# EasyEDA Pro project foc电动螺丝刀.eprj, schematic Schematic1
Board Name: Board1; Create Date: 2025-11-18; Page Name: P1; Project Name: foc电动螺丝刀; Schematic Name: Schematic1; Update Date: 2025-12-09; Company: 嘉立创EDA; Page Size: A4; Version: V1.0
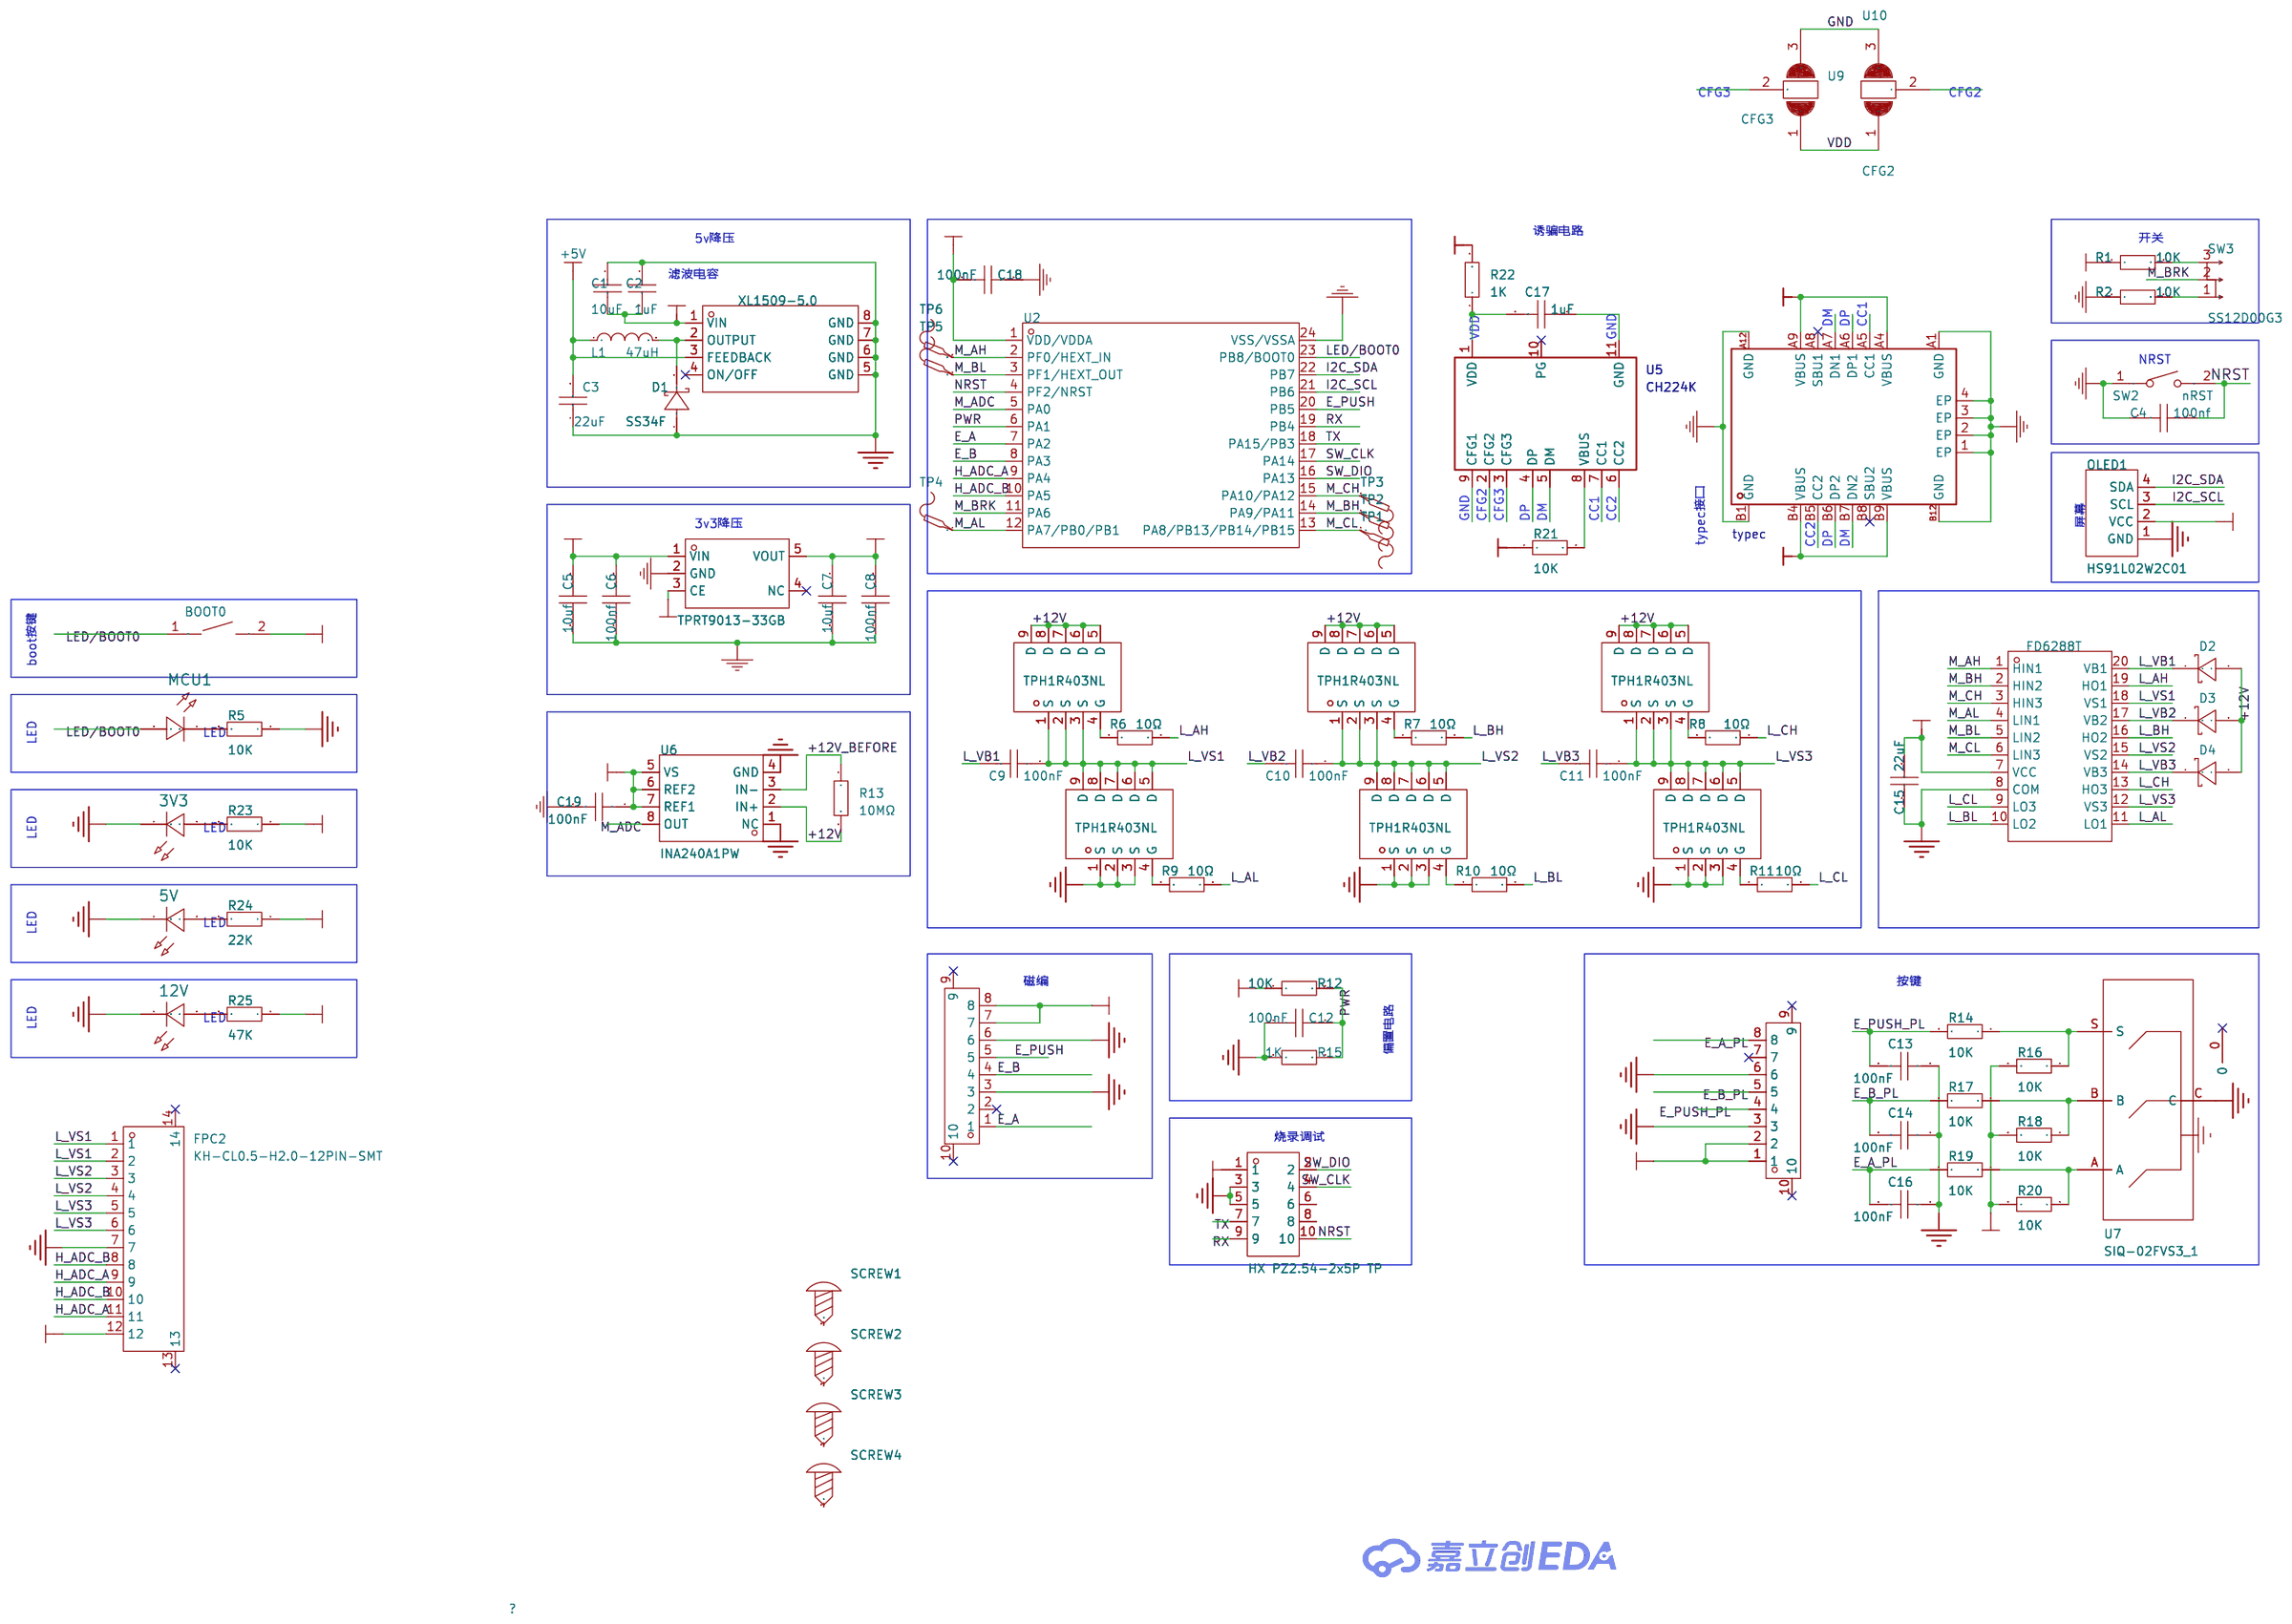
[diagram p0: schematic sheet]

## Parts
3V3  -  [LED_0603]
5V  -  [LED_0603]
12V  -  [LED_0603]
BOOT0  轻触按键3*4*H  [SW-SMD_L4.0-W2.9-LS5.0]
C1  10uF  [C1206]
C2  1uF  [C0603]
C3  22uF  [C1206]
C4  100nf  [C0603]
C5  10uf  [C1206]
C6  100nf  [C0603]
C7  10uf  [C1206]
C8  100nf  [C0603]
C9  100nF  [C0603]
C10  100nF  [C0603]
C11  100nF  [C0603]
C12  100nF  [C0603]
C13  100nF  [C0603]
C14  100nF  [C0603]
C15  22uF  [C0805]
C16  100nF  [C0603]
C17  1uF  [C0603]
C18  100nF  [C0603]
C19  100nF  [C0603]
D1  SS34F  [SMAF_L3.5-W2.6-LS4.7-FD]
D2  1N5819WS  [SOD-323_L1.8-W1.3-LS2.5-RD]
D3  1N5819WS  [SOD-323_L1.8-W1.3-LS2.5-RD]
D4  1N5819WS  [SOD-323_L1.8-W1.3-LS2.5-RD]
FPC1  FPC-05F-8PH20  [FPC-SMD_8P-P0.50_FPC-05F-8PH20]
FPC2  KH-CL0.5-H2.0-12PIN-SMT  [FPC-SMD_12P-P0.50_KH-CL0.5-H2.0-12PIN-SMT]
FPC3  FPC-05F-8PH20  [FPC-SMD_8P-P0.50_FPC-05F-8PH20]
L1  47uH  [IND-SMD_L7.0-W6.6_FXL0630]
MCU1  -  [LED_0603]
OLED1  HS91L02W2C01  [OLED-TH_L38.0-W12.0_HS91L02W2C01]
P1  HX PZ2.54-2x5P TP  [HDR-SMD_10P-P2.54-V-M-R2-C5-LS7.5]
Q1  TPH1R403NL  [DSOP-8_L5.0-W5.0-P1.27-LS6.0-BL-EP]
Q2  TPH1R403NL  [DSOP-8_L5.0-W5.0-P1.27-LS6.0-BL-EP]
Q3  TPH1R403NL  [DSOP-8_L5.0-W5.0-P1.27-LS6.0-BL-EP]
Q4  TPH1R403NL  [DSOP-8_L5.0-W5.0-P1.27-LS6.0-BL-EP]
Q5  TPH1R403NL  [DSOP-8_L5.0-W5.0-P1.27-LS6.0-BL-EP]
Q6  TPH1R403NL  [DSOP-8_L5.0-W5.0-P1.27-LS6.0-BL-EP]
R1  10K  [R0603]
R2  10K  [R0603]
R5  10K  [R0603]
R6  10Ω  [R0603]
R7  10Ω  [R0603]
R8  10Ω  [R0603]
R9  10Ω  [R0603]
R10  10Ω  [R0603]
R11  10Ω  [R0603]
R12  10K  [R0603]
R13  10MΩ  [R2512]
R14  10K  [R0603]
R15  1K  [R0603]
R16  10K  [R0603]
R17  10K  [R0603]
R18  10K  [R0603]
R19  10K  [R0603]
R20  10K  [R0603]
R21  10K  [R0603]
R22  1K  [R0603]
R23  10K  [R0603]
R24  22K  [R0603]
R25  47K  [R0603]
SCREW1  -  [M2螺丝]
SCREW2  -  [M2螺丝]
SCREW3  -  [M2螺丝]
SCREW4  -  [M2螺丝]
SW2  nRST  [SW-SMD_L4.0-W2.9-LS5.0]
SW3  SS12D00G3  [SW-TH_SS-12D01-GX]
TP1  -  [Test-Point-0.5mm]  (no BOM)
TP2  -  [Test-Point-0.5mm]  (no BOM)
TP3  -  [Test-Point-0.5mm]  (no BOM)
TP4  -  [Test-Point-0.5mm]  (no BOM)
TP5  -  [Test-Point-0.5mm]  (no BOM)
TP6  -  [Test-Point-0.5mm]  (no BOM)
U1  XL1509-5.0  [SOIC-8_L4.9-W3.9-P1.27-LS6.0-TR]
U2  -  [TSSOP-24_L7.8-W4.4-P0.65-LS6.4-BL]
U4  TPRT9013-33GB  [SOT-23-5_L3.0-W1.7-P0.95-LS2.8-BL]
U5  CH224K  [ESSOP-10_L4.9-W3.9-P1.0-LS6.0-TL-EP]
U6  INA240A1PW  [TSSOP-8_L4.4-W3.0-P0.65-LS6.4-TL]
U7  SIQ-02FVS3_1  [SW-SMD_SIQ-02FVS3_1]
U8  FD6288T  [TSSOP-20_L6.5-W4.4-P0.65-LS6.4-BL]
U9  CFG3  [双置短接焊盘]
U10  CFG2  [双置短接焊盘]
USB1  typec  [USB-C-SMD_KH-TYPE-C-16P]

## Library data of the parts
3V3 5V 12V MCU1 = LED_0603-R: Supplier Footprint: 0603
BOOT0 SW2 = 轻触按键3*4*H: Supplier Part: C9900017573; Supplier Footprint: 轻触按键3*4*2.5; JLCPCB Part Class: 扩展库; Supplier: LCSC
C1 = CL31A106KBHNNNE: 容值:10uF;精度:±10%;额定电压:50V;材质(温度系数):X5R;; LCSC Part Name: 10uF ±10% 50V; Supplier Part: C13585; Manufacturer: SAMSUNG(三星); Supplier Footprint: 1206; Datasheet: https://atta.szlcsc.com/upload/public/pdf/source/20160103/1457707668742.pdf; Supplier: LCSC; Tolerance: ±10%; Voltage Rated: 50V; Temperature Coefficient: X5R
C2 = CL10A105KB8NNNC: 容值:1uF;精度:±10%;额定电压:50V;材质(温度系数):X5R;; LCSC Part Name: 1uF ±10% 50V; Supplier Part: C15849; Manufacturer: SAMSUNG(三星); Supplier Footprint: 0603; JLCPCB Part Class: Basic Part; Datasheet: https://atta.szlcsc.com/upload/public/pdf/source/20160218/1457707763339.pdf; Supplier: LCSC; Tolerance: ±10%; Voltage Rated: 50V; Temperature Coefficient: X5R
C3 = CGA1206X5R226M350NT: 容值:22uF;精度:±20%;额定电压:35V;温度系数:X5R;; LCSC Part Name: 22uF ±20% 35V; Supplier Part: C6119969; Manufacturer: HRE(芯声); Supplier Footprint: 1206; JLCPCB Part Class: Extended Part; Datasheet: https://item.szlcsc.com/datasheet/CGA1206X5R226M350NT/7062675.html; Supplier: LCSC; Tolerance: ±20%; Voltage Rating: 35V; Temperature Coefficient: X5R
C4 C6 C8 = 100nf: link: https://item.szlcsc.com/362304.html; 3DModel: C0603_L1.6-W0.8-H0.8
C5 C7 = HGC1206R5106K500NSPJ: 容值:10uF;精度:±10%;额定电压:50V;温度系数:X5R;; LCSC Part Name: 10uF ±10% 50V; Supplier Part: C7432781; Manufacturer: Chinocera(华瓷); Supplier Footprint: 1206; JLCPCB Part Class: Extended Part; Datasheet: https://atta.szlcsc.com/upload/public/pdf/source/20240320/FAC3FEC40A78BC5CCCE96C232A94D860.pdf; Supplier: LCSC; Tolerance: ±10%; Voltage Rating: 50V; Temperature Coefficient: X5R
C9-C11 = CC0603KRX7R9BB104: 容值:100nF;精度:±10%;额定电压:50V;材质(温度系数):X7R;; LCSC Part Name: 100nF ±10% 50V; Supplier Part: C14663; Manufacturer: YAGEO(国巨); Supplier Footprint: 0603; JLCPCB Part Class: 基础库; Datasheet: https://atta.szlcsc.com/upload/public/pdf/source/20180910/C282072_33301C7F631E79921B82A8DAC6BCC5B3.pdf; Supplier: LCSC; Tolerance: ±10%; Voltage Rated: 50V; Temperature Coefficient: X7R
C12-C14 C16-C19 = CAP_0603: Supplier Footprint: 0603
C15 = CGA0805X5R226M350MT: LCSC Part Name: 22uF ±20% 35V; Supplier Part: C6119901; Manufacturer: HRE(芯声); Supplier Footprint: 0805; JLCPCB Part Class: Extended Part; Datasheet: https://atta.szlcsc.com/upload/public/pdf/source/20231129/D589D0CC4D260F7AC3A77E53B455CCB3.pdf; Supplier: LCSC; Tolerance: ±20%; Voltage Rated: 35V; Temperature Coefficient: X5R
D1 = SS34F_C908239: 二极管配置:独立式;正向压降(Vf):550mV@3A;直流反向耐压(Vr):40V;平均整流电流(Io):3A;; LCSC Part Name: 电压:40V 电流:3A; Supplier Part: C908239; Manufacturer: FUXINSEMI(富芯森美); Supplier Footprint: SMAF(DO-214AD); Datasheet: https://atta.szlcsc.com/upload/public/pdf/source/20201027/C908239_FC8ECC0377ED2542EFBAA82131BEFB7E.pdf; Supplier: LCSC; Diode Configuration: 独立式; Forward Voltage (Vf@If): 550mV@3A; Reverse Voltage (Vr): 40V; Average Rectified Current (Io): 3A; Reverse Leakage Current (Ir): 500nA
D2-D4 = 1N5819WS_C191023: 正向压降(Vf):600mV@1A;直流反向耐压(Vr):40V;平均整流电流(Io):1A;; LCSC Part Name: 电压:40V 电流:1A; Supplier Part: C191023; Manufacturer: Hottech(合科泰); Supplier Footprint: SOD-323; JLCPCB Part Class: 基础库; Datasheet: https://atta.szlcsc.com/upload/public/pdf/source/20220428/3CB86FD8D28D653594B4E35F9D5AEFD9.pdf; Supplier: LCSC; Forward Voltage (Vf@If): 600mV@1A; Reverse Voltage (Vr): 40V; Average Rectified Current (Io): 1A
FPC1 FPC3 = FPC-05F-8PH20: 锁定特性:翻盖式;触点类型:下接;触点数量:8P;间距:0.5mm;安装类型:卧贴;工作温度范围:-25℃~+85℃;; LCSC Part Name: 间距:0.5mm P数:8P 翻盖式 下接; Supplier Part: C2856797; Manufacturer: XUNPU(讯普); Supplier Footprint: SMD,P=0.5mm,卧贴; Datasheet: https://atta.szlcsc.com/upload/public/pdf/source/20210728/C2856796_EA80EFD10E16055FE067E7763B90421F.pdf; Supplier: LCSC; Locking Feature: 翻盖式; Contact Type: 下接; Number of Contacts: 8P; Pitch: 0.5mm; Mounting Type: 卧贴; FFC, FCB Thickness: 0.3mm; Height Above Board: 2mm; Operating Temperature Range: -25℃~+85℃
FPC2 = KH-CL0.5-H2.0-12PIN-SMT: LCSC Part Name: 抽屉式 下接 P数:12P 间距:0.5mm; Supplier Part: C22370889; Manufacturer: kinghelm(金航标); Supplier Footprint: SMD,P=0.5mm,卧贴; JLCPCB Part Class: 扩展库; Datasheet: https://atta.szlcsc.com/upload/public/pdf/source/20240328/5AE8AE061BAE655BE0EEC39E0F785CE5.pdf; Supplier: LCSC; Locking Feature: 抽屉式; Contact Type: 下接; Number of Contacts: 12P; Pitch: 0.5mm
L1 = FXL0630-470-M: 电感值:47uH;精度:±20%;额定电流:1.5A;饱和电流(Isat):2A;类型:一体成型电感;; LCSC Part Name: 47uH ±20% 2A; Supplier Part: C475913; Manufacturer: cjiang(长江微电); Supplier Footprint: SMD,6.6x7mm; JLCPCB Part Class: Extended Part; Datasheet: https://atta.szlcsc.com/upload/public/pdf/source/20240426/3189EA8206330E2108542F9E34E540E7.pdf; Supplier: LCSC; Tolerance: ±20%; Rated Current: 1.5A; Saturation Current (Isat): 2A; DC Resistance (DCR): 385mΩ; Type: 一体成型电感
OLED1 = HS91L02W2C01: LCSC Part Name: 0.91寸OLED显示屏白光IIC; Supplier Part: C5248081; Manufacturer: HS(汉昇); JLCPCB Part Class: 扩展库; Datasheet: https://atta.szlcsc.com/upload/public/pdf/source/20230727/C3E43C8E3DDA847F5681FEE7D95C153D.pdf; Supplier: LCSC; Main Control Chip: SSD1306; Interface Type: I2C; Size: 0.91; Pixel Resolution: 128x32; Operating Temperature: -40℃~+70℃
P1 = HX PZ2.54-2x5P TP: LCSC Part Name: 2x5P 间距:2.54mm 方针 立贴; Supplier Part: C32713285; Manufacturer: hanxia(韩下); Supplier Footprint: SMD,P=2.54mm; JLCPCB Part Class: Extended Part; Datasheet: https://item.szlcsc.com/datasheet/HX%2520PZ2.54-2x5P%2520TP/34444565.html; Supplier: LCSC; Pin Structure: 2x5P; Pitch: 2.54mm; Row Spacing: 2.54mm; Circluar Pins/Square Pins: 方针; Mounting Type: 立贴; Number of Rows: 双排; Number of Pins: 10P; Current Rating: 3A; Voltage Rating (Max): 1kV; Length of Mating Pin: 6mm; Insulation Height: 2.5mm; Contact Material: 黄铜; Contact Plating: 金; Operating Temperature: -40℃~+105℃; Color: 黑色
Q1-Q6 = TPH1R403NL_C83440: 类型:N沟道;漏源电压(Vdss):30V;连续漏极电流(Id):150A;功率(Pd):64W;导通电阻(RDS(on)@Vgs,Id):1.4mΩ@10V,30A;阈值电压(Vgs(th)@Id):2.3V@500uA;; LCSC Part Name: N沟道 耐压:30V 电流:150A; Supplier Part: C83440; Manufacturer: TOSHIBA(东芝); Supplier Footprint: DFN-8(5x6); JLCPCB Part Class: 扩展库; Datasheet: https://atta.szlcsc.com/upload/public/pdf/source/20170908/C83440_1504870121708958077.pdf; Supplier: LCSC; Type: N沟道; Drain Source Voltage (Vdss): 30V; Continuous Drain Current (Id): 150A; Power Dissipation (Pd): 64W; Drain Source On Resistance (RDS(on)@Vgs,Id): 1.4mΩ@10V,30A; Gate Threshold Voltage (Vgs(th)@Id): 2.3V@500uA
R1 R2 R5 R12 R15 R21-R25 = Res_0603: Supplier Footprint: 0603
R6-R11 = 0603WAF100JT5E: 电阻类型:厚膜电阻;阻值:10Ω;精度:±1%;功率:100mW;最大工作电压:75V;温度系数:±400ppm/℃;; LCSC Part Name: 10Ω ±1% 100mW 厚膜电阻; Supplier Part: C22859; Manufacturer: UNI-ROYAL(厚声); Supplier Footprint: 0603; JLCPCB Part Class: 基础库; Datasheet: https://atta.szlcsc.com/upload/public/pdf/source/20200306/C422600_1E6D84923E4A46A82E41ADD87F860B5C.pdf; Supplier: LCSC; Type: 厚膜电阻; Tolerance: ±1%; Power(Watts): 100mW; Overload Voltage (Max): 75V; Temperature Coefficient: ±400ppm/℃; Operating Temperature Range: -55℃~+155℃
R13 = CR2512J10M0E04Z: 电阻类型:厚膜电阻;阻值:10MΩ;精度:±5%;功率:1W;工作电压:200V;温度系数:±100ppm/℃;; LCSC Part Name: 厚膜电阻 10MΩ ±5% 1W; Supplier Part: C175503; Manufacturer: EVER OHMS(天二科技); Supplier Footprint: 2512; JLCPCB Part Class: 扩展库; Datasheet: https://atta.szlcsc.com/upload/public/pdf/source/20250725/88D6B0FBDD5EA0CBAC61CDC8208240BE.pdf; Supplier: LCSC; Type: 厚膜电阻; Tolerance: ±5%; Power(Watts): 1W; Voltage-Supply(Max): 200V; Temperature Coefficient: ±100ppm/℃; Operating Temperature: -55℃~+155℃
R14 R16-R20 = 10K: 3DModel: R0603_L1.6-W0.8-H0.8; link: https://www.mouser.in/datasheet/2/447/PYu_RT_1_to_0_01_RoHS_L_11-1669912.pdf; Supplier: LCSC; Supplier Part: C217687; Manufacturer: Viking Tech; Manufacturer Part: ARG03FTC1002; JLCPCB Part Class: Extended Part
SCREW1-SCREW4 = M2螺丝: Supplier Footprint: 插件
SW3 = SS12D00G3: Supplier Part: C9900018735; Supplier Footprint: SW-TH; JLCPCB Part Class: 扩展库; Supplier: LCSC
TP1-TP6 = Test-Point
U1 = XL1509-5.0: Supplier Part: C2902368; Manufacturer: UMW(广东友台半导体); Supplier Footprint: SOIC-8; Datasheet: https://atta.szlcsc.com/upload/public/pdf/source/20230412/A4F395BE4384B04485E6C784EB623363.pdf; Supplier: LCSC
U2 = AT32M416ExP7: Manufacturer: Artery Technology
U4 = TPRT9013-33GB: 输出类型:-;; Supplier Part: C587158; Manufacturer: TECH PUBLIC(台舟); Supplier Footprint: SOT-23-5; JLCPCB Part Class: Extended Part; Datasheet: https://atta.szlcsc.com/upload/public/pdf/source/20210810/692D4D0C3CF190F9330EFD28C3E572CB.pdf; Supplier: LCSC
U5 = CH224K: LCSC Part Name: USB PD等多快充协议受电芯片CH224; Supplier Part: C970725; Manufacturer: WCH(南京沁恒); Supplier Footprint: ESSOP-10-150mil-1mm; JLCPCB Part Class: 扩展库; Datasheet: https://atta.szlcsc.com/upload/public/pdf/source/20240313/43C2AFDDBDD1F65B60386D2CCAB0811B.pdf; Supplier: LCSC; Applications Function: USB充电芯片
U6 = INA240A1PW: 放大器数:单路;; Supplier Part: C1346518; Manufacturer: TI(德州仪器); Supplier Footprint: TSSOP-8; JLCPCB Part Class: 扩展库; Datasheet: https://www.ti.com/cn/lit/gpn/ina2180; Supplier: LCSC; Number of Channels: 单路; Supply Current: 1.8mA; Operating Temperature: -40℃~+125℃
U7 = SIQ-02FVS3_1: Supplier Part: C2912904; Supplier Footprint: SMD; JLCPCB Part Class: 扩展库; Supplier: LCSC
U8 = FD6288T_C5804616: 驱动配置:高低侧;负载类型:MOSFET;峰值灌电流:1.5A;峰值拉电流:1.8A;电源电压:8V~20V;; Supplier Part: C5804616; Manufacturer: JSMSEMI(杰盛微); Supplier Footprint: TSSOP-20; JLCPCB Part Class: Extended Part; Datasheet: https://atta.szlcsc.com/upload/public/pdf/source/20230505/E489ED7BEA890DFBBDAD461AC13FC372.pdf; Supplier: LCSC; Driven Configuration: 高低侧; Load Type: MOSFET; Peak Output Current(sink): 1.5A; Peak Output Current(source): 1.8A; Supply Voltage: 8V~20V
U9 U10 = 双置短接焊盘
USB1 = typec: Supplier Part: C9900016956; Supplier Footprint: typec 12p; JLCPCB Part Class: 扩展库; Supplier: LCSC

## Nets
+3V3: BOOT0.2 C7.1 C8.2 C18.1 C19.1 FPC1.7 FPC1.8 FPC2.12 OLED1.2(VCC) P1.1 R1.1 R23.1 U2.1(VDD/VDDA) U4.5(VOUT) U6.5(VS) U6.6(REF2) U6.7(REF1)
+3V3_PL: FPC3.1 FPC3.2 R16.2 R18.2 R20.2
+5V: C3.2 C5.1 C6.2 L1.1 R24.1 U1.3(FEEDBACK) U4.1(VIN) U4.3(CE)
+12V: C1.1 C2.1 C15.2 D2.2(A) D3.2(A) D4.2(A) Q1.5(D) Q1.6(D) Q1.7(D) Q1.8(D) Q1.9(D) Q2.5(D) Q2.6(D) Q2.7(D) Q2.8(D) Q2.9(D) Q3.5(D) Q3.6(D) Q3.7(D) Q3.8(D) Q3.9(D) R12.1 R13.2 R25.1 U1.1(VIN) U6.2(IN+) U8.7(VCC)
+12V_BEFORE: R13.1 R21.1 R22.2 U6.3(IN-) USB1.A4(VBUS) USB1.A9(VBUS) USB1.B4(VBUS) USB1.B9(VBUS)
GND: 3V3.1(C) 5V.1(C) 12V.1(C) C1.2 C2.2 C3.1 C4.2 C5.2 C6.1 C7.2 C8.1 C12.1 C13.1 C14.1 C15.1 C16.1 C17.1 C18.2 C19.2 D1.1(A) FPC1.3 FPC1.6 FPC2.7 FPC3.3 FPC3.6 OLED1.1(GND) P1.3 P1.5 Q4.1(S) Q4.2(S) Q4.3(S) Q5.1(S) Q5.2(S) Q5.3(S) Q6.1(S) Q6.2(S) Q6.3(S) R2.1 R5.1 R15.1 SW2.1 U1.5(GND) U1.6(GND) U1.7(GND) U1.8(GND) U2.24(VSS/VSSA) U4.2(GND) U5.9(CFG1) U5.11(GND) U6.1(NC) U6.4(GND) U7.C U8.8(COM) U9.3(2) U10.3(2) USB1.1(EP) USB1.2(EP) USB1.3(EP) USB1.4(EP) USB1.A1(GND) USB1.A12(GND) USB1.B1(GND) USB1.B12(GND)
VDD: C17.2 R22.1 U5.1(VDD) U9.1 U10.1
CC1: U5.7(CC1) USB1.A5(CC1)
CC2: U5.6(CC2) USB1.B5(CC2)
CFG2: U5.2(CFG2) U10.2
CFG3: U5.3(CFG3) U9.2
DM: U5.5(DM) USB1.A7(DN1) USB1.B7(DN2)
DP: U5.4(DP) USB1.A6(DP1) USB1.B6(DP2)
E_A: FPC1.1 U2.7(PA2)
E_A_PL: C16.2 FPC3.8 R19.2
E_B: FPC1.4 U2.8(PA3)
E_B_PL: C14.2 FPC3.5 R17.2
E_PUSH: FPC1.5 U2.20(PB5)
E_PUSH_PL: C13.2 FPC3.4 R14.2
H_ADC_A: FPC2.9 FPC2.11 U2.9(PA4)
H_ADC_B: FPC2.8 FPC2.10 U2.10(PA5)
I2C_SCL: OLED1.3(SCL) U2.21(PB6)
I2C_SDA: OLED1.4(SDA) U2.22(PB7)
L_AH: R6.2 U8.19(HO1)
L_AL: R9.2 U8.11(LO1)
L_BH: R7.2 U8.16(HO2)
L_BL: R10.2 U8.10(LO2)
L_CH: R8.2 U8.13(HO3)
L_CL: R11.2 U8.9(LO3)
L_VB1: C9.1 D2.1(K) U8.20(VB1)
L_VB2: C10.1 D3.1(K) U8.17(VB2)
L_VB3: C11.1 D4.1(K) U8.14(VB3)
L_VS1: C9.2 FPC2.1 FPC2.2 Q1.1(S) Q1.2(S) Q1.3(S) Q4.5(D) Q4.6(D) Q4.7(D) Q4.8(D) Q4.9(D) U8.18(VS1)
L_VS2: C10.2 FPC2.3 FPC2.4 Q2.1(S) Q2.2(S) Q2.3(S) Q5.5(D) Q5.6(D) Q5.7(D) Q5.8(D) Q5.9(D) U8.15(VS2)
L_VS3: C11.2 FPC2.5 FPC2.6 Q3.1(S) Q3.2(S) Q3.3(S) Q6.5(D) Q6.6(D) Q6.7(D) Q6.8(D) Q6.9(D) U8.12(VS3)
LED/BOOT0: BOOT0.1 MCU1.2(A) U2.23(PB8/BOOT0)
M_ADC: U2.5(PA0) U6.8(OUT)
M_AH: TP6.1 U2.2(PF0/HEXT_IN) U8.1(HIN1)
M_AL: TP4.1 U2.12(PA7/PB0/PB1) U8.4(LIN1)
M_BH: TP2.1 U2.14(PA9/PA11) U8.2(HIN2)
M_BL: TP5.1 U2.3(PF1/HEXT_OUT) U8.5(LIN2)
M_BRK: SW3.2 U2.11(PA6)
M_CH: TP3.1 U2.15(PA10/PA12) U8.3(HIN3)
M_CL: TP1.1 U2.13(PA8/PB13/PB14/PB15) U8.6(LIN3)
NRST: C4.1 P1.10 SW2.2 U2.4(PF2/NRST)
PWR: C12.2 R12.2 R15.2 U2.6(PA1)
RX: P1.9 U2.19(PB4)
SW_CLK: P1.4 U2.17(PA14)
SW_DIO: P1.2 U2.16(PA13)
TX: P1.7 U2.18(PA15/PB3)
$1N1931: R19.1 R20.1 U7.A
$1N1933: R17.1 R18.1 U7.B
$1N1934: R14.1 R16.1 U7.S
$1N3741: Q4.4(G) R9.1
$1N3748: Q5.4(G) R10.1
$1N3762: Q1.4(G) R6.1
$1N3769: Q2.4(G) R7.1
$1N3776: Q3.4(G) R8.1
$1N3872: Q6.4(G) R11.1
$1N4187: D1.2(K) L1.2 U1.2(OUTPUT)
$1N5948: R21.2 U5.8(VBUS)
$1N6225: R1.2 SW3.3
$1N6251: R2.2 SW3.1
$1N10226: 3V3.2(A) R23.2
$1N10294: 5V.2(A) R24.2
$1N10362: 12V.2(A) R25.2
$1N25782: MCU1.1(C) R5.2

Not connected (* = marked no-connect by the designer): FPC1 2* 9* 10*; FPC2 13* 14*; FPC3 7* 9* 10*; P1 6 8; SCREW1 1; SCREW2 1; SCREW3 1; SCREW4 1; U1 4(ON/OFF)*; U4 4(NC)*; U5 10(PG)*; U7 0*; USB1 A8(SBU1)* B8(SBU2)*

## Notes on the sheet
- 5v降压
- 诱骗电路
- 开关
- 滤波电容
- NRST
- 3v3降压
- 屏幕
- typec接口
- boot按键
- LED
- LED
- LED
- LED
- LED
- LED
- 磁编
- 按键
- LED
- LED
- 偏置电路
- 烧录调试
